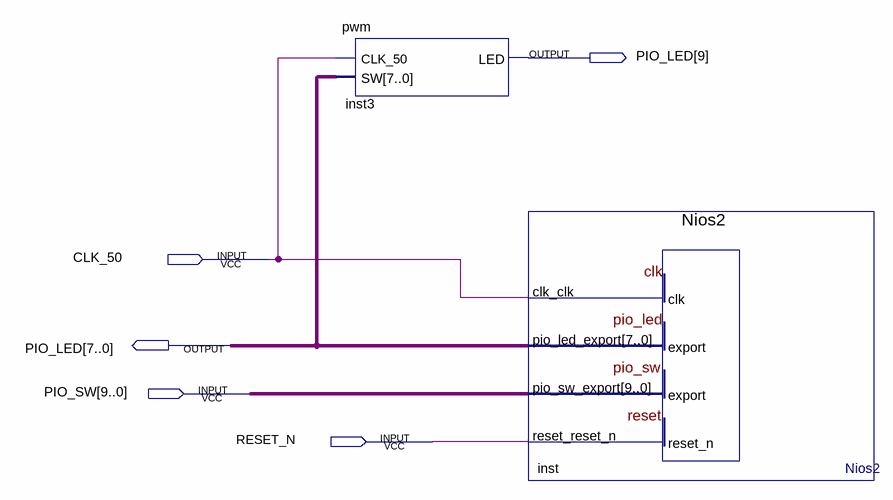
[diagram p0: schematic sheet]
// Quartus schematic Nios2_top.bdf as structural Verilog: 2 symbols, 5 pins
module Nios2_top (
  input  CLK_50,
  input  [9:0] PIO_SW,
  input  RESET_N,
  output [9:0] PIO_LED
);

  pwm inst3 (.CLK_50(CLK_50), .SW(PIO_LED[7:0]), .LED(PIO_LED[9]));
  Nios2 inst (.clk_clk(CLK_50), .pio_sw_export(PIO_SW), .reset_reset_n(RESET_N), .pio_led_export(PIO_LED[7:0]));
endmodule
